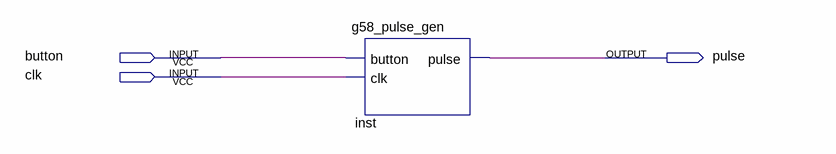
[diagram p0: schematic sheet]
// Quartus schematic g58_pulse_gen_test.bdf as structural Verilog: 1 symbols, 3 pins
module g58_pulse_gen_test (
  input  button,
  input  clk,
  output pulse
);

  g58_pulse_gen inst (.button(button), .clk(clk), .pulse(pulse));
endmodule
